# EAGLE design Agit POVera rev 3 (EAGLE 6.5.0)
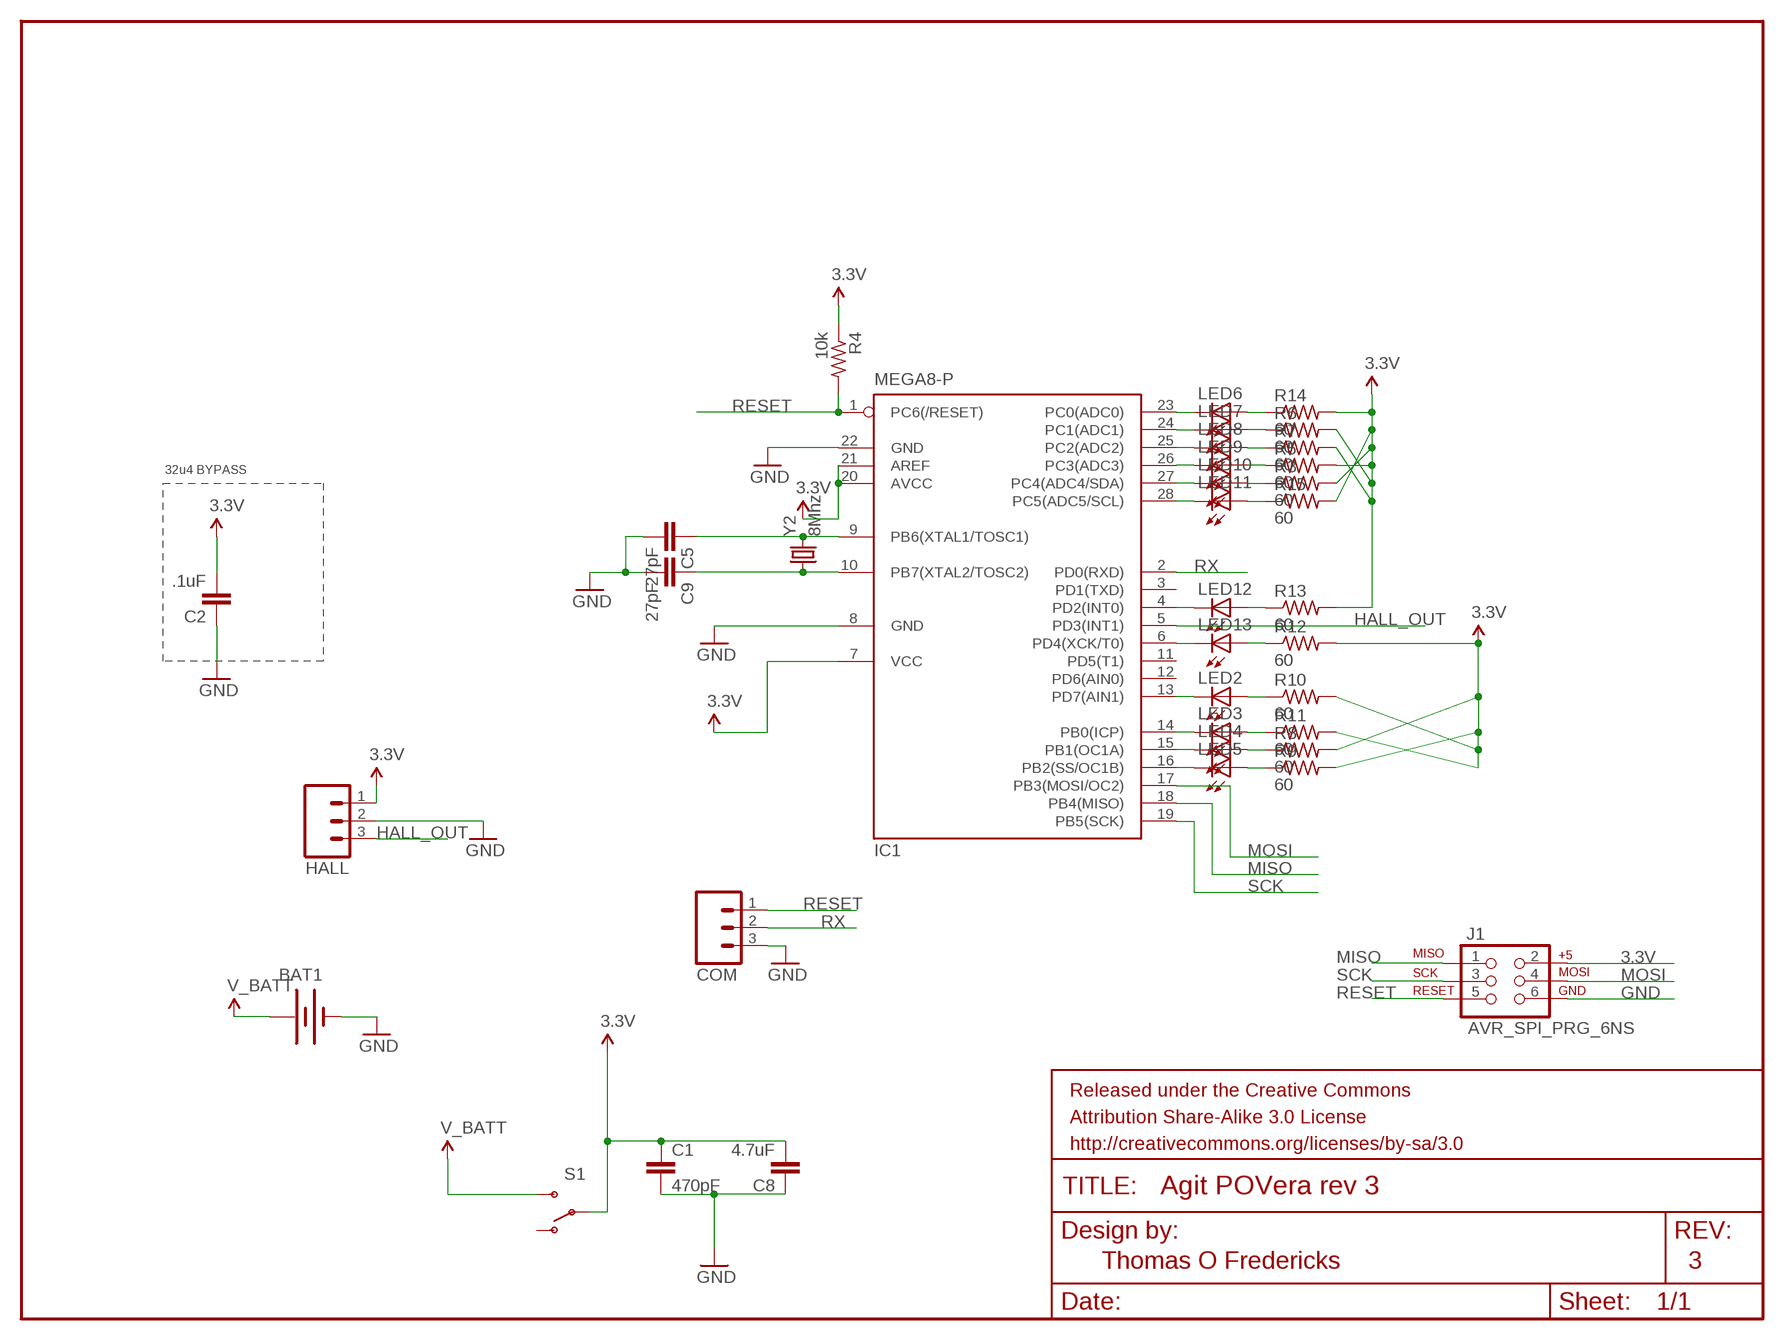
[diagram p0: schematic, sheet 1]

## Parts
BAT1  BATTERY20PTH  [BATTCOM_20MM_PTH]
C1  470pF  CAPEZ  [CAP-PTH-SMALLEZ]
C2  .1uF  CAPEZ  [CAP-PTH-SMALLEZ]
C5  27pF  CAPEZ  [CAP-PTH-SMALLEZ]
C8  4.7uF  CAPEZ  [CAP-PTH-SMALLEZ]
C9  27pF  CAPEZ  [CAP-PTH-SMALLEZ]
COM  M03PTH  [1X03]
HALL  M03PTH  [1X03]
IC1  MEGA8-P  [DIL28-3]
J1  AVR_SPI_PRG_6NS  [2X3-NS]
LED2  LED5MM  [LED5MM]
LED3  LED5MM  [LED5MM]
LED4  LED5MM  [LED5MM]
LED5  LED5MM  [LED5MM]
LED6  LED5MM  [LED5MM]
LED7  LED5MM  [LED5MM]
LED8  LED5MM  [LED5MM]
LED9  LED5MM  [LED5MM]
LED10  LED5MM  [LED5MM]
LED11  LED5MM  [LED5MM]
LED12  LED5MM  [LED5MM]
LED13  LED5MM  [LED5MM]
R3  60  R-US_0204/7  [0204/7]
R4  10k  R-US_0204/7  [0204/7]
R5  60  R-US_0204/7  [0204/7]
R6  60  R-US_0204/7  [0204/7]
R7  60  R-US_0204/7  [0204/7]
R8  60  R-US_0204/7  [0204/7]
R9  60  R-US_0204/7  [0204/7]
R10  60  R-US_0204/7  [0204/7]
R11  60  R-US_0204/7  [0204/7]
R12  60  R-US_0204/7  [0204/7]
R13  60  R-US_0204/7  [0204/7]
R14  60  R-US_0204/7  [0204/7]
R15  60  R-US_0204/7  [0204/7]
S1  SWITCH-SPDTPTH  [SWITCH-SPDT]
Y2  8Mhz  CRYSTALHC49US  [HC49US]

## Nets
3.3V: C1.1 C2.2 C8.2 HALL.1 IC1.7(VCC) IC1.20(AVCC) IC1.21(AREF) J1.2 R3.2 R4.1 R5.2 R6.2 R7.2 R8.2 R9.2 R10.2 R11.2 R12.2 R13.2 R14.2 R15.2 S1.2(P)
GND: BAT1.2(-) C1.2 C2.1 C5.2 C8.1 C9.2 COM.3 HALL.2 IC1.8(GND) IC1.22(GND) J1.6
HALL_OUT: HALL.3 IC1.5(PD3(INT1))
MISO: IC1.18(PB4(MISO)) J1.1
MOSI: IC1.17(PB3(MOSI/OC2)) J1.4
N$1: IC1.24(PC1(ADC1)) LED7.K(C)
N$2: IC1.25(PC2(ADC2)) LED8.K(C)
N$3: IC1.26(PC3(ADC3)) LED9.K(C)
N$4: IC1.4(PD2(INT0)) LED12.K(C)
N$5: IC1.27(PC4(ADC4/SDA)) LED10.K(C)
N$6: IC1.28(PC5(ADC5/SCL)) LED11.K(C)
N$7: IC1.23(PC0(ADC0)) LED6.K(C)
N$8: IC1.13(PD7(AIN1)) LED2.K(C)
N$9: IC1.14(PB0(ICP)) LED3.K(C)
N$10: IC1.15(PB1(OC1A)) LED4.K(C)
N$11: IC1.16(PB2(SS/OC1B)) LED5.K(C)
N$12: IC1.6(PD4(XCK/T0)) LED13.K(C)
N$13: LED9.A R5.1
N$14: LED7.A R6.1
N$15: LED12.A R13.1
N$16: LED13.A R12.1
N$17: LED3.A R11.1
N$18: LED2.A R10.1
N$19: LED5.A R9.1
N$20: LED4.A R8.1
N$21: LED8.A R7.1
N$22: LED10.A R3.1
N$23: LED11.A R15.1
N$25: LED6.A R14.1
N$34: C5.1 IC1.9(PB6(XTAL1/TOSC1)) Y2.2
N$35: C9.1 IC1.10(PB7(XTAL2/TOSC2)) Y2.1
RESET: COM.1 IC1.1(PC6(/RESET)) J1.5 R4.2
RX: COM.2 IC1.2(PD0(RXD))
SCK: IC1.19(PB5(SCK)) J1.3
V_BATT: BAT1.1(+) S1.3(S)
Unconnected: IC1.3(PD1(TXD)) IC1.11(PD5(T1)) IC1.12(PD6(AIN0)) S1.1(O)

## Notes on the sheet
- 32u4 BYPASS
- Thomas O Fredericks | 3

## Library data of the parts
BAT1 = SparkFun-Electromechanical:BATTERY: Battery Holders Various common sizes : AA, AAA, 20mm coin cell and 12mm coin cell. 20MM_4LEGS, BATT-10373
C1 = SparkFun-Passives:CAP: Capacitor Standard 0603 ceramic capacitor, and 0.1" leaded capacitor.; PROD_ID: CAP-07884
C2 = SparkFun-Passives:CAP: Capacitor Standard 0603 ceramic capacitor, and 0.1" leaded capacitor.; PROD_ID: CAP-00810
C5 C8 C9 = SparkFun-Passives:CAP: Capacitor Standard 0603 ceramic capacitor, and 0.1" leaded capacitor.; PROD_ID: CAP-10300
COM HALL = SparkFun-Connectors:M03: Header 3 Standard 3-pin 0.1" header. Use with straight break away headers (SKU : PRT-00116), right angle break away headers (PRT-00553), swiss pins (PRT-00743), machine pins (PRT-00117), and female headers (PRT-00115). Molex polarized connector foot print use with SKU : PRT-08232 with associated crimp pins and housings.
IC1 = atmel:MEGA8-P: MICROCONTROLLER 8 Kbytes FLASH, 1 kbytes SRAM, 512 bytes EEPROM, USART, 4-channel 10 bit ADC, 2-channel 8 bit ADC Pin compatible with Atmega48, ATMega88, ATMega168 Source: avr.lbr; OC_FARNELL: unknown; OC_NEWARK: unknown
J1 = SparkFun-Connectors:AVR_SPI_PRG_6: AVR ISP 6 Pin This is the reduced ISP connector for AVR programming. Common on Arduino. This footprint will take up less PCB space and can be used with a 10-pin to 6-pin adapter such as SKU: BOB-08508
LED2-LED13 = SparkFun-LED:LED: LEDs Standard schematic elements and footprints for 5mm, 3mm, 1206, and 0603 sized LEDs. 5mm - Spark Fun Electronics SKU : COM-00529 (and others)
R3-R15 = resistor:R-US_: RESISTOR, American symbol; PROD_ID: RES-00824
S1 = SparkFun-Electromechanical:SWITCH-SPDT: SPDT Switch Simple slide switch, Spark Fun Electronics SKU : COM-00102 DPDT SMT slide switch, AYZ0202, SWCH-08179
Y2 = SparkFun-FreqCtrl:CRYSTAL: Various standard crystals. Proven footprints. Spark Fun Electronics SKU : COM-00534

## Board
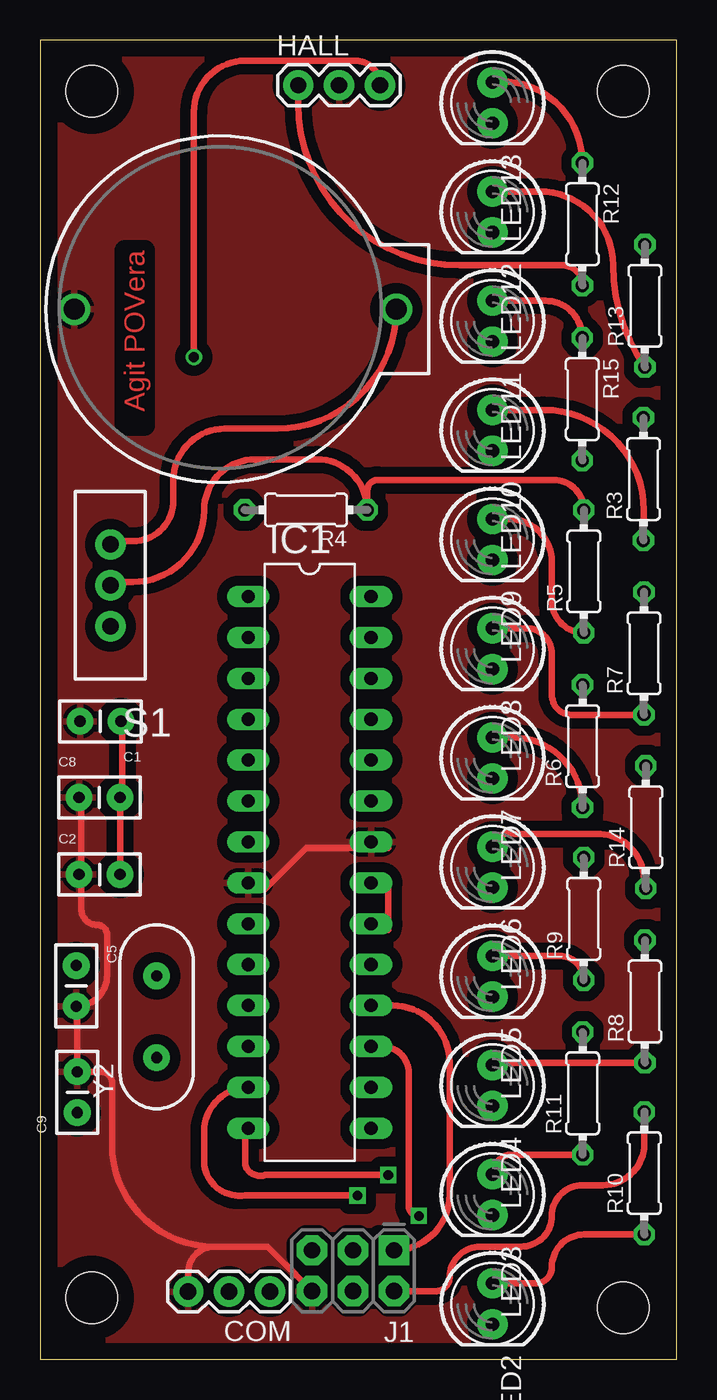
[diagram p1: board, top side]
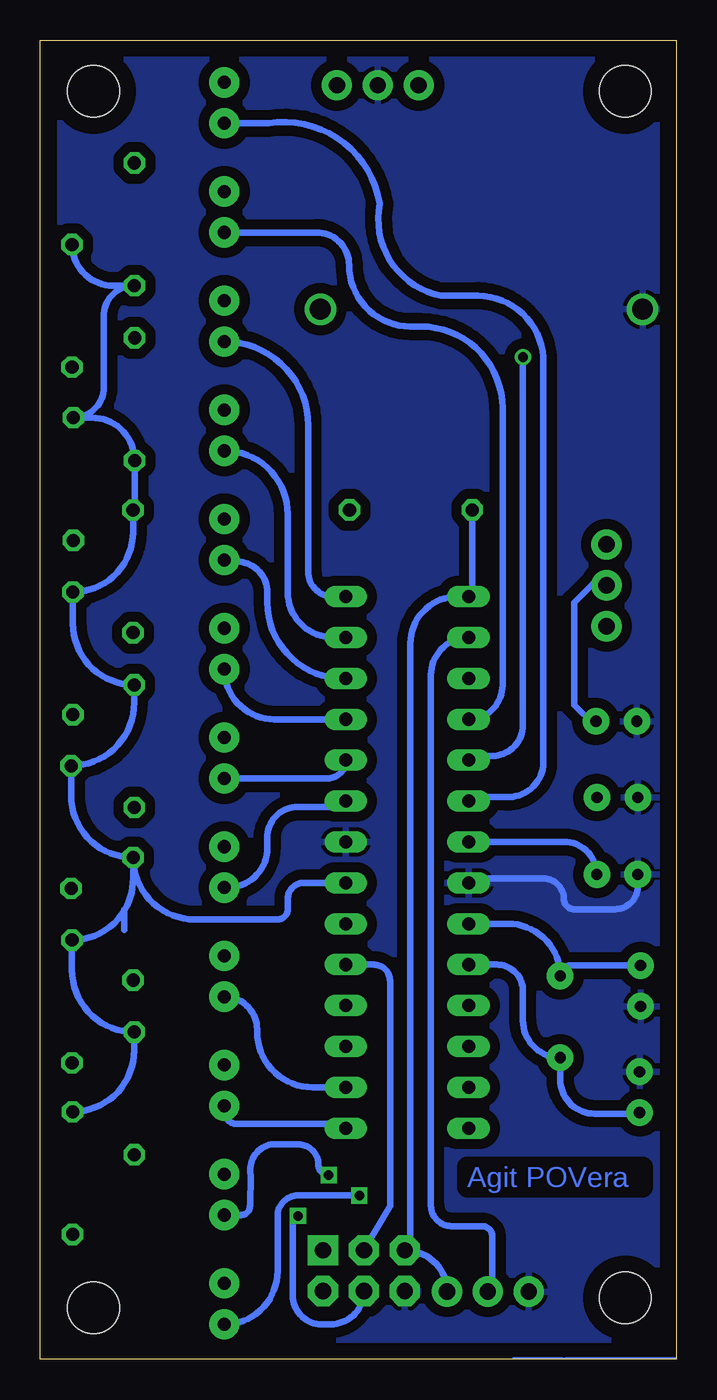
[diagram p2: board, bottom side, seen from below]

Size 39.5 x 81.92 mm. Coordinates in mm from the lower left corner, seen from the top.
Outline: 0,0 39.5,0 39.5,81.92 0,81.92 0,0
Copper layers (1*16): Top 0.035mm / dielectric 1.5mm / Bottom 0.035mm
Design rules "default *": minimum track width 16mil, minimum drill 24mil, track to track 8mil, track to pad 8mil, pad to pad 8mil, via to via 8mil, smd to smd 8mil, copper to edge 40mil, drill to drill 8mil, minimum pad ring 10mil, minimum via ring 8mil, stop-mask expansion 4mil, vias tented up to drill 0mil, thermal gap 10mil
Holes 3.2 mm at 3.17,78.74 36.2,78.74 3.17,3.81 36.2,3.17

### Footprints (pad centres in the part's own frame; a part is rotated, then mirrored left to right if it is on the bottom)
BATTCOM_20MM_PTH = drill 1.3: 1 20,0; 2 0,0
CAP-PTH-SMALLEZ = drill 0.7 pad 1.651: 1 0,0; 2 2.54,0
1X03 = drill 1.016 pad 1.88: 1 0,0; 2 2.54,0; 3 5.08,0
DIL28-3 = drill 0.813 long: 1 -16.51,-3.81; 2 -13.97,-3.81; 3 -11.43,-3.81; 4 -8.89,-3.81; 5 -6.35,-3.81; 6 -3.81,-3.81; 7 -1.27,-3.81; 8 1.27,-3.81; 9 3.81,-3.81; 10 6.35,-3.81; 11 8.89,-3.81; 12 11.43,-3.81; 13 13.97,-3.81; 14 16.51,-3.81; 15 16.51,3.81; 16 13.97,3.81; 17 11.43,3.81; 18 8.89,3.81; 19 6.35,3.81; 20 3.81,3.81; 21 1.27,3.81; 22 -1.27,3.81; 23 -3.81,3.81; 24 -6.35,3.81; 25 -8.89,3.81; 26 -11.43,3.81; 27 -13.97,3.81; 28 -16.51,3.81
2X3-NS = drill 1.016 pad 1.88 square: 1 -2.54,-1.27 | drill 1.016 pad 1.88 octagon: 2 -2.54,1.27; 3 0,-1.27; 4 0,1.27; 5 2.54,-1.27; 6 2.54,1.27
LED5MM = drill 0.813 pad 1.88: A -1.27,0; K 1.27,0
0204/7 = drill 0.813 octagon: 1 -3.81,0; 2 3.81,0
SWITCH-SPDT = drill 1.016 pad 1.88: 1 0,2.54; 2 0,0; 3 0,-2.54
HC49US = drill 0.7 pad 1.651: 1 -2.54,0; 2 2.54,0

### Placement (x,y rotation side)
BAT1  2.1,65.21 0 top
C1  5,39.61 180 top
C2  2.4,30.1 0 top
C5  2.22,24.45 270 top
C8  2.39,34.88 0 top
C9  2.29,15.3 90 top
COM  14.25,4.19 180 top
HALL  16,79.12 0 top
IC1  16.71,30.85 270 top
J1  19.41,5.49 180 top
LED2  28.07,3.43 270 top
LED3  28.07,10.21 270 top
LED4  28.07,16.99 270 top
LED5  28.07,23.77 270 top
LED6  28.07,30.56 270 top
LED7  28.07,37.34 270 top
LED8  28.07,44.12 270 top
LED9  28.07,50.9 270 top
LED10  28.07,57.68 270 top
LED11  28.07,64.47 270 top
LED12  28.07,71.25 270 top
LED13  28.07,78.03 270 top
R3  37.44,54.66 90 top
R4  16.48,52.74 180 top
R5  33.74,48.93 90 top
R6  33.66,38.07 90 top
R7  37.47,43.83 90 top
R8  37.53,22.21 90 top
R9  33.73,27.34 90 top
R10  37.49,11.55 90 top
R11  33.67,16.5 90 top
R12  33.65,70.48 270 top
R13  37.53,65.42 90 top
R14  37.59,33.04 90 top
R15  33.64,59.62 270 top
S1  4.34,48.06 180 top
Y2  7.21,21.26 90 top

### Tracks (layer width: path | path; a pad name or v marks a point on that pad's centre or on a via)
3.3V
  Top 0.406: R12.2 arc90 32.38,67.94 26.04,67.94 arc-90 16,77.98 HALL.1 | R4.1 20.3,53.95 arc-90 20.95,54.61 31.86,54.61 arc-90 R5.2 | C1.1 5.08,39.37 5.08,35.56 C8.2 arc-90 C8.2 C2.2 | IC1.20 21.59,26.67 21.59,29.21 IC1.21 | 20.32,53.34 R4.1 | S1.2 5.08,48.26 5.71,48.26 arc90 10.16,52.7 arc-90 13.34,55.88 17.16,55.88 arc-90 R4.1 | J1.2 24.54,4.22 arc90 25.4,5.08 arc-90 27.3,6.99 29.84,6.99 arc90 31.75,8.89 arc-90 33.66,10.79 34.92,10.79 arc90 37.49,13.36 R10.2
  Bottom 0.406: R9.2 arc90 37.59,35.01 R14.2 arc-90 33.66,40.77 R6.2 arc90 37.47,45.69 R7.2 arc-90 33.74,51.38 R5.2 arc-90 33.64,52.83 R15.2 arc-90 36.3,58.47 R3.2 arc-90 35.56,60.35 35.56,64.76 arc90 R12.2 34.98,66.67 arc90 R13.2 | R9.2 33.73,29.82 arc30 34.24,27.91 | 34.24,27.91 arc60 R8.2 37.53,24.17 arc-90 R11.2 33.67,19.18 arc90 R10.2 | 34.29,26.67 34.29,27.94 34.24,27.91 | IC1.21 23.13,29.58 arc-90 24.13,28.57 24.13,27.94 arc90 24.77,27.3 29.88,27.3 arc90 R9.2 | C1.1 5.08,39.37 6.35,40.64 6.35,46.99 5.08,48.26 S1.2 | IC1.7 6.96,32.12 arc90 C2.2
GND
  Top 0.406: IC1.8 13.97,29.21 16.51,31.75 20.32,31.75 IC1.22 21.59,31.75 | C8.1 2.54,34.29 2.54,30.48 C2.1 arc-90 2.54,29.96 2.54,27.94 arc90 3.51,26.97 arc-90 4.13,26.35 4.13,23.82 arc-90 C5.2 arc-90 2.29,21.84 C9.2 3.75,17.84 arc-90 4.45,17.14 4.45,13.34 arc90 10.79,6.99 | 10.79,6.99 14.1,6.99 J1.6 | 10.79,6.99 arc90 9.17,5.36 COM.3
  Bottom 0.406: 2.22,29.92 arc-90 C2.1 2.4,29.35 arc90 3.81,27.94 6.35,27.94 arc90 6.99,28.57 arc-90 8.26,29.84 12.64,29.84 arc-90 IC1.8
  pour Top: 15.24,48.26 18.41,48.26 18.41,13.34 15.24,13.34
  pour Bottom (isolate 0.635): 0.64,81.28 38.73,81.28 38.73,0.64 0.64,0.64
  pour Top (isolate 0.635): 1.27,81.28 38.73,81.28 38.73,0.64 1.27,0.64
HALL_OUT  (via drill 0.61)
  Top 0.406: v9.53,62.23 9.53,77.47 arc-90 12.7,80.64 19.56,80.64 arc-90 HALL.3
  Bottom 0.406: v9.53,62.23 9.53,39.37 arc90 11.43,37.47 12.64,37.47 arc-90 IC1.5 12.7,36.83
MISO
  Top 0.406: IC1.18 21.86,21.96 arc-90 25.4,18.41 25.4,10.21 arc-90 J1.1
MOSI  (via drill 0.6)
  Top 0.406: IC1.17 21.22,19.42 arc-90 22.86,17.78 22.86,9.53 arc90 v23.5,8.89
  Bottom 0.406: v23.5,8.89 arc-90 23.82,8.57 23.82,3.94 arc-90 22.05,2.17 21.46,2.17 arc-90 J1.4
N$1
  Bottom 0.406: LED7.K 21.65,36.07 arc-90 IC1.24
N$2
  Bottom 0.406: IC1.25 24.96,39.74 arc90 LED8.K
N$3
  Bottom 0.406: IC1.26 20.69,42.28 arc90 25.4,46.99 25.4,47.62 arc-90 27.3,49.53 27.96,49.53 arc90 LED9.K
N$4
  Bottom 0.406: LED12.K 22.35,69.98 arc90 20.32,67.94 arc-90 16.51,64.14 15.88,64.14 arc90 10.79,59.05 10.79,41.85 arc90 IC1.4
N$5
  Bottom 0.406: IC1.27 21.32,44.82 arc90 24.13,47.62 24.13,52.48 arc-90 LED10.K
N$6
  Bottom 0.406: IC1.28 21.32,47.36 arc90 22.86,48.9 22.86,57.99 arc-90 LED11.K
N$7
  Bottom 0.406: LED6.K 27.86,29.29 arc-90 25.4,31.75 25.4,32.38 arc90 23.5,34.29 20.89,34.29 arc-90 IC1.23
N$8  (via drill 0.6)
  Top 0.406: v19.68,10.16 12.7,10.16 arc-90 10.16,12.06 10.16,14.13 arc-90 IC1.13
  Bottom 0.406: LED2.K arc-90 24.77,5.46 24.77,8.89 arc90 23.5,10.16 v19.68,10.16
N$9  (via drill 0.6)
  Top 0.406: IC1.14 arc90 12.7,14.13 12.7,12.06 arc90 13.97,11.43 v21.59,11.43
  Bottom 0.406: LED3.K 27.06,8.94 arc-90 26.47,9.53 26.43,11.43 arc90 25.16,13.34 23.5,13.34 arc90 22.23,12.06 arc-90 v21.59,11.43
N$10
  Bottom 0.406: IC1.15 arc-90 20.79,14.61 27.3,14.61 arc90 28.07,15.37 LED4.K
N$11
  Bottom 0.406: IC1.16 22.59,16.88 arc90 26.04,20.32 26.04,20.47 arc-90 LED5.K
N$12
  Bottom 0.406: LED13.K 25.32,76.76 arc90 18.41,71.75 arc-90 14.61,66.04 12.7,66.04 arc90 8.26,62.23 8.26,36.83 arc90 10.79,34.92 12.64,34.92 arc-90 IC1.6
N$13
  Top 0.406: LED9.A 29.11,52.17 arc-90 31.75,49.53 31.75,47.1 arc90 R5.1
N$14
  Top 0.406: LED7.A 29.31,38.61 arc-90 R6.1
N$15
  Top 0.406: LED12.A 30.99,72.52 arc-90 35.56,67.94 arc35 R13.1
N$16
  Top 0.406: R12.1 R12.1 arc90 28.57,79.38 28.14,79.38 arc90 LED13.A
N$17
  Top 0.406: LED3.A arc-90 29.28,12.69 R11.1
N$18
  Top 0.406: LED2.A 30.73,4.7 arc90 31.75,5.71 arc-90 33.78,7.74 R10.1
N$19
  Top 0.406: LED5.A 32.22,25.04 arc-90 R9.1
N$20
  Top 0.406: LED4.A arc-90 28.21,18.4 R8.1
N$21
  Top 0.406: LED8.A 30.18,45.39 arc-90 31.75,43.81 31.75,41.27 arc90 33.02,40.01 37.45,40.01 arc90 R7.1
N$22
  Top 0.406: LED10.A 31.22,58.95 arc-90 37.47,52.7 37.47,50.88 arc-90 R3.1
N$23
  Top 0.406: R15.1 arc90 31.34,65.73 LED11.A
N$25
  Top 0.406: LED6.A arc-90 29.46,32.63 34.49,32.63 arc-90 37.47,29.84 37.47,29.35 arc90 R14.1
N$34
  Bottom 0.406: IC1.9 10.45,27.04 arc90 Y2.2 arc90 6.57,24.45 C5.1
N$35
  Bottom 0.406: IC1.10 11.16,24.5 arc90 9.53,22.86 9.53,21.03 arc-90 Y2.1 7.21,17.37 arc-90 5.08,15.24 2.35,15.24 arc-90 C9.1
RESET
  Bottom 0.406: COM.1 arc-90 16.82,6.76 J1.5 arc-90 16.51,7.11 16.51,44.45 arc90 13.6,47.36 IC1.1 arc-90 12.68,47.59 R4.2
RX
  Bottom 0.406: COM.2 arc-90 11.43,4.42 11.43,7.62 arc-90 12.06,8.26 13.97,8.26 arc90 15.24,9.53 15.24,42.48 arc90 IC1.2
SCK
  Bottom 0.406: IC1.19 18.78,24.5 arc90 17.78,23.5 17.78,9.53 J1.3
V_BATT
  Top 0.406: S1.3 5.08,50.8 5.71,50.8 arc90 8.26,53.34 8.26,54.61 arc-90 11.43,57.78 14.68,57.78 arc90 BAT1.1
(copper drawn outside any net)
  shapes: Bottom area x8

### Text on the board
Top: Agit POVera
Bottom: Agit POVera
201bmp: /Users/alx/Desktop/AgitPOV_Coyote_master/circuit/coyote 1/logos_coyote_1.bmp